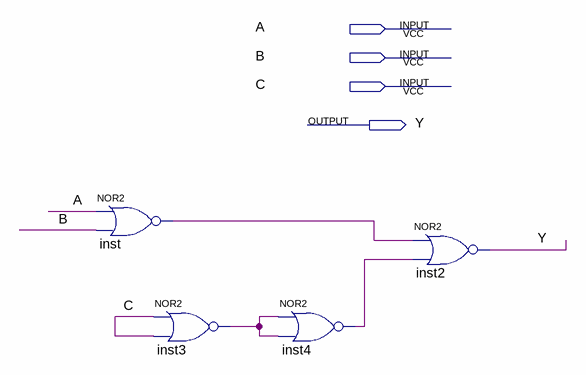
[diagram p0: schematic sheet]
// Quartus schematic Lab1Quiz.bdf as structural Verilog: 4 symbols, 4 pins
module Lab1Quiz (
  input  A,
  input  B,
  input  C,
  output Y
);

  wire inst3_out, inst4_out, inst_out;

  nor inst (inst_out, A, B);
  nor inst3 (inst3_out, C, C);
  nor inst4 (inst4_out, inst3_out, inst3_out);
  nor inst2 (Y, inst_out, inst4_out);
endmodule
